# EasyEDA Pro project backup.epro, board PCB_1
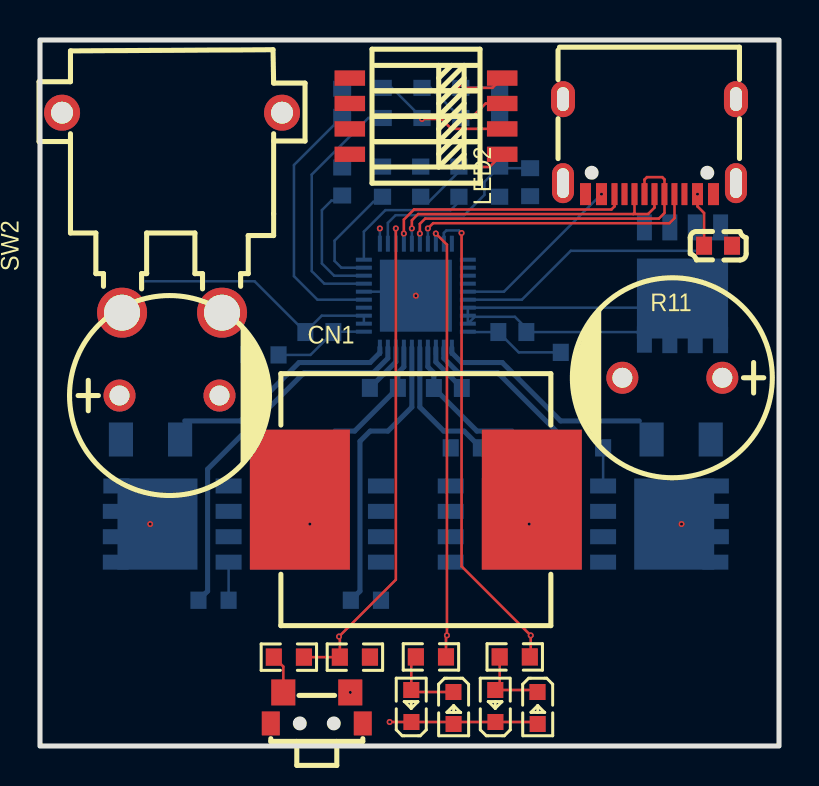
[diagram p8: board, top side]
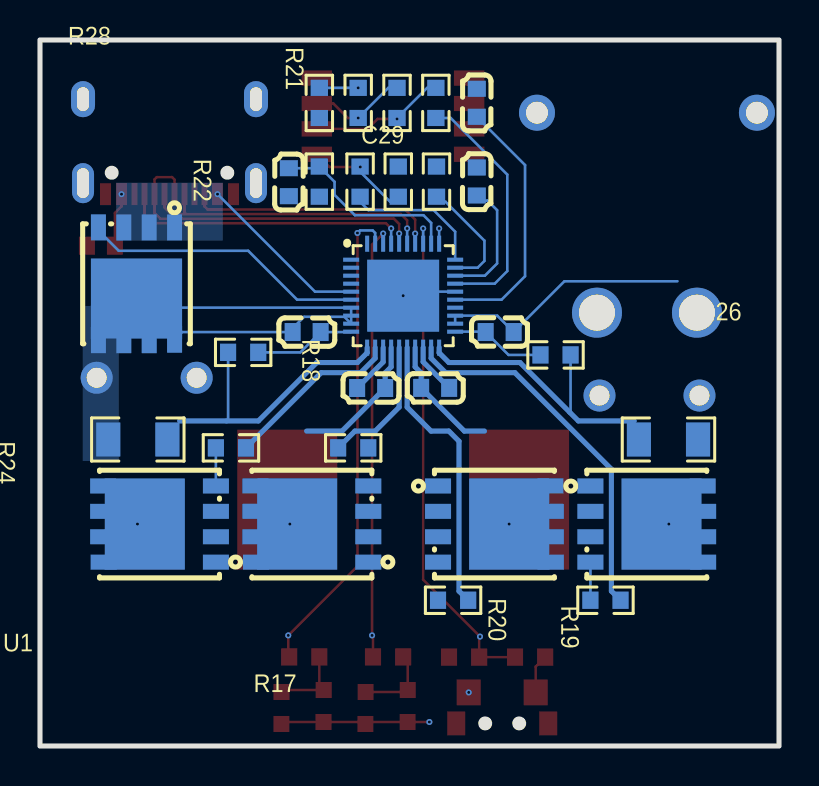
[diagram p9: board, bottom side, seen from below]

Outline 36.96 x 35.31 mm; copper layers: Top Layer, VCC/SIGANL, GND, Bottom Layer. Coordinates in mm from the lower left corner of the outline.
Outline path: rectangle 0,35.31 36.96,0
Stack: Top Layer 0.035mm 外层铜厚1oz / Dielectric1 0.2104mm 7628 RC49% 8.6mil / VCC/SIGANL 0.0152mm 内层铜厚 / Dielectric2 1.065mm 1.1mm H/HOZ 含铜 / GND 0.0152mm 内层铜厚 / Dielectric3 0.2104mm 7628 RC49% 8.6mil / Bottom Layer 0.035mm 外层铜厚1oz

## Design rules (mm)
template: 自定义配置
spacing copperThickness1oz: track to track 0.102, other pairs 0.152 to 0.3
spacing copperThickness2oz: track to track 0.203, other pairs 0.152 to 0.3
spacing 6mil (default): track to track 0.102, other pairs 0.152 to 0.152
track width copperThickness1oz (default): min 0.127, default 0.254, max 2.54
track width copperThickness2oz: min 0.203, default 0.254, max 2.54
track width 10mil: min 0.254, default 0.254, max 2.54
track width 20mil: min 0.508, default 0.508, max 2.54
differential pair differentialPair (default): width min 0.127, default 0.254, max 2.54; gap min 0.152, default 0.152
differential pair err=5mil: width min 0.127, default 0.254, max 2.54; gap min 0.152, default 0.254
via viaSize: diameter min 0.5, default 0.61, max 10; hole min 0.3, default 0.305, max 6.299
via 12-24: diameter min 0.5, default 0.61, max 10; hole min 0.3, default 0.305, max 6.299
via 6-12 (default): diameter min 0.305, default 0.305, max 10; hole min 0.152, default 0.152, max 6.299

## Placement (name value [footprint] x y rotation side)
C20  2.2uF  [C0603]  15.11 32.17 90 bottom
C22  100nF  [C0603]  24.51 28.19 270 bottom
C23  2.2uF  [C0603]  15.11 28.23 90 bottom
C29  470nF  [C0603]  23.62 20.7 0 bottom
C30  470nF  [C0603]  13.97 20.7 180 bottom
C35  1000uF  [CAP-TH_BD10.0-P5.00-D0.6-FD-A]  31.62 18.41 180 top
C36  470nF  [C0603]  20.4 17.9 180 bottom
C37  470nF  [C0603]  17.2 17.91 0 bottom
C38  1000uF  [CAP-TH_BD10.0-P5.00-D0.6-FD-A]  6.48 17.53 0 top
C39  22uF  [C0603]  33.91 25.02 180 top
CN1  XT30PW-M  [CONN-TH_XT30PW-M]  6.6 26.67 180 top
L1  10uH  [IND-SMD_L12.6-W13.5]  18.8 12.32 180 top
LED1  NCD0603R1  [LED0603-RD_RED]  18.57 2 90 top
LED2  NCD0603R1  [LED0603-RD_RED]  20.68 1.9 270 top
LED3  NCD0603R1  [LED0603-RD_RED]  22.77 2 90 top
LED4  NCD0603R1  [LED0603-RD_RED]  24.88 1.9 270 top
Q2  BSC0702LS  [PG-TDSON-8_L5.0-W6.0-P1.27-BL-EP]  32.13 23.11 0 bottom
Q3  BSC0702LS  [PG-TDSON-8_L5.0-W6.0-P1.27-BL-EP]  30.98 11.1 90 bottom
Q4  BSC0702LS  [PG-TDSON-8_L5.0-W6.0-P1.27-BL-EP]  14.23 11.1 270 bottom
Q5  BSC0702LS  [PG-TDSON-8_L5.0-W6.0-P1.27-BL-EP]  23.36 11.1 90 bottom
Q6  BSC0702LS  [PG-TDSON-8_L5.0-W6.0-P1.27-BL-EP]  6.61 11.1 270 bottom
R7  51Ω  [R0603]  26.8 19.68 180 bottom
R8  5mΩ  [R1206]  32.06 15.33 180 bottom
R9  10Ω  [R0603]  11.18 19.56 0 bottom
R10  5mΩ  [R1206]  5.53 15.33 180 bottom
R11  100Ω  [R0603]  19.55 4.45 180 top
R12  100Ω  [R0603]  23.74 4.45 180 top
R15  43kΩ  [R0603]  12.45 4.44 0 top
R16  10kΩ  [R0603]  15.75 4.44 180 top
R17  27kΩ  [R0603]  17.13 28.22 90 bottom
R18  3.6K  [R0603]  20.95 28.22 90 bottom
R19  5.5K  [R0603]  19.04 28.22 90 bottom
R20  6.2K  [R0603]  17.16 32.16 90 bottom
R21  2.9K  [R0603]  19.1 32.16 90 bottom
R22  4.9K  [R0603]  21.05 32.16 90 bottom
R23  5K  [R0603]  22.99 32.16 270 bottom
R24  NCP18XH103F03RB  [R0603]  22.99 28.22 270 bottom
R25  2Ω  [R0603]  27.41 14.91 0 bottom
R26  2Ω  [R0603]  21.29 14.91 180 bottom
R27  2Ω  [R0603]  8.68 7.29 180 bottom
R28  2Ω  [R0603]  16.3 7.29 180 bottom
SW1  TS24CA  [SW-SMD_TS24CA]  13.84 1.9 180 top
SW2  DSHP04TSGET  [SW-SMD_8P-L6.7-W5.4-P1.27-LS8.4]  19.3 31.5 90 top
U1  -  [IP2366]  21.3 20.02 180 bottom
USB1  TYPE-C 16PIN 2MD(073)  [USB-C-SMD_TYPE-C-6PIN-2MD-073]  30.48 29.97 180 top

## Footprints (pads in the part's own frame, mm; a bottom-side part is the same pattern mirrored in y, then rotated)
C0603
  rect 0.8x0.9 smd: 1(-0.7,0) 2(0.7,0)
CAP-TH_BD10.0-P5.00-D0.6-FD-A
  round 1.6 hole 1: 1(-2.5,0) 2(2.5,0)
CONN-TH_XT30PW-M
  round 2.5 hole 1.8: 1(-2.5,5) 2(2.5,5)
  round 1.8 hole 1.1: 3(5.5,-5) 4(-5.5,-5)
IND-SMD_L12.6-W13.5
  rect 5x7 smd: 1(-5.8,0) 2(5.8,0)
IP2366
  rect 0.8x0.2 smd: 1(-0.1,4.3) 2(-0.1,3.9) 3(-0.1,3.5) 4(-0.1,3.1) 5(-0.1,2.7) 6(-0.1,2.3) 7(-0.1,1.9) 8(-0.1,1.5) 9(-0.1,1.1) 10(-0.1,0.7) 21(5.1,0.7) 22(5.1,1.1) 23(5.1,1.5) 24(5.1,1.9) 25(5.1,2.3) 26(5.1,2.7) 27(5.1,3.1) 28(5.1,3.5) 29(5.1,3.9) 30(5.1,4.3)
  rect 0.2x0.8 smd: 11(0.7,-0.1) 12(1.1,-0.1) 13(1.5,-0.1) 14(1.9,-0.1) 15(2.3,-0.1) 16(2.7,-0.1) 17(3.1,-0.1) 18(3.5,-0.1) 19(3.9,-0.1) 20(4.3,-0.1) 31(4.3,5.1) 32(3.9,5.1) 33(3.5,5.1) 34(3.1,5.1) 35(2.7,5.1) 36(2.3,5.1) 37(1.9,5.1) 38(1.5,5.1) 39(1.1,5.1) 40(0.7,5.1)
  rect 3.6x3.6 smd: 41(2.5,2.5)
LED0603-RD_RED
  rect 0.8x0.8 smd: 1(-0.799,-0.004) 2(0.799,0.004)
PG-TDSON-8_L5.0-W6.0-P1.27-BL-EP
  rect 0.75x1.3 smd: 1(-1.905,-2.82) 2(-0.635,-2.82) 3(0.635,-2.82) 4(1.905,-2.82) 5(1.905,2.82) 6(0.635,2.82) 7(-0.635,2.82) 8(-1.905,2.794)
  rect 4.56x4 smd: 8(0,0.737)
R0603
  rect 0.806x0.864 smd: 1(-0.753,0) 2(0.753,0)
R1206
  rect 1.208x1.701 smd: 1(-1.479,0) 2(1.479,0)
SW-SMD_8P-L6.7-W5.4-P1.27-LS8.4
  rect 0.762x1.524 smd: 1(-1.905,-3.81) 2(-0.635,-3.81) 3(0.635,-3.81) 4(1.905,-3.81) 5(1.905,3.81) 6(0.635,3.81) 7(-0.635,3.81) 8(-1.905,3.81)
SW-SMD_TS24CA
  rect 0.9x1.2 smd: 1(-2.3,0.775) 2(2.3,0.775)
  rect 1.2x1.3 smd: 3(-1.675,-0.775) 4(1.675,-0.775)
USB-C-SMD_TYPE-C-6PIN-2MD-073
  rect 0.55x1.1 smd: 1(-3.2,2.375) 2(-2.4,2.375) 11(2.4,2.375) 12(3.2,2.375)
  rect 0.3x1.1 smd: 3(-1.75,2.375) 4(-1.25,2.375) 5(-0.75,2.375) 6(-0.25,2.375) 7(0.25,2.375) 8(0.75,2.375) 9(1.25,2.375) 10(1.75,2.375)
  oval 1.1x2 hole 0.6x1.5: 13(-4.325,1.825) 14(4.325,1.825)
  oval 1.2x1.8 hole 0.6x1.2: 13(-4.325,-2.375) 14(4.325,-2.375)

## Nets
As in the schematic.

Pads without a net: U1 1 2 3 4 24 40; USB1 3 9

## Via types
v1: diameter 0.305, hole 0.152, Top Layer to Bottom Layer, 24 vias

## Routing (per net, layer and track width the routed paths; a pad name or vN(x,y) marks a point on that pad's centre or on a via; arc(x,y) is an arc through that point)
GND: length 2.7
  Bottom Layer w0.127: U1.26 18.6,22.72 v1(18.8,22.52)
VBUS: length 11.4
  Top Layer w0.127: v1(32.88,27.6) 32.88,26.98 33.21,26.65 33.21,25.02
  Bottom Layer w0.127: U1.5 23.2,22.72 v1(28.08,27.6)
3S: length 6.8
  Top Layer w0.127: v1(19.1,31.36) 20.08,31.36 20.57,30.86 SW2.2
  Bottom Layer w0.127: R21.1 17.6,32.91 R20.2
4S: length 4.9
  Top Layer w0.127: SW2.3 22.29,32.13 21.56,31.41 v1(21.05,31.41)
  Bottom Layer w0.127: R21.2 19.54,32.91 v1(21.05,31.41)
5S: length 4.2
  Top Layer w0.127: SW2.4 22.63,32.91 v1(21.05,32.91)
  Bottom Layer w0.127: R23.1 v1(21.05,32.91)
$C20_1: length 13
  Bottom Layer w0.127: C20.1 12.7,29.05 12.7,23.49 13.88,22.32 U1.25
$C23_1: length 6.2
  Bottom Layer w0.127: 15.11,27.28 14.58,27.28 14.1,26.8 14.1,24.13 14.71,23.52 U1.28
$C29_1: length 5.1
  Bottom Layer w0.127: R7.2 23.94,19.68 C29.1 21.41,20.7 U1.10
$C29_2: length 21.3
  Bottom Layer w0.127: Q2.8 31.67,21.92 U1.7 U1.8 U1.9 21.74,21.46 23.75,21.46 24.32,20.89 C29.2 29.84,20.7 Q2.8
$C30_1: length 4.7
  Bottom Layer w0.127: R9.2 13.53,19.56 C30.1 14.69,20.72 U1.21
$C36_1: length 2.6
  Bottom Layer w0.254: U1.13 19.8,19.2 C36.1
$C36_2: length 7
  Bottom Layer w0.254: 23.62,15.75 21.85,15.75 C36.2 19.7,18.66 19.4,18.96 U1.14
  vias: v1(24.46,11.1)
$C37_1: length 2.5
  Bottom Layer w0.254: C37.1 17.8,19.21 U1.18
$C37_2: length 6.2
  Bottom Layer w0.254: 14.73,15.75 15.74,15.75 C37.2 17.9,18.66 18.2,18.96 U1.17
  vias: v1(13.5,11.1)
$LED1_2: length 3.9
  Top Layer w0.127: R11.2 18.57,4.22 LED1.2 18.67,2.7 LED2.1
$LED3_2: length 3.9
  Top Layer w0.127: LED4.1 24.78,2.8 LED3.2 22.99,3.02 R12.2
$Q2_4: length 14.2
  Bottom Layer w0.127: U1.6 24.1,22.32 26.54,24.76 33.02,24.76 34.04,25.78 Q2.4
$Q3_4: length 1.9
  Bottom Layer w0.127: 28.16,13 R25.2
$Q3_5: length 14.5
  Bottom Layer w0.127: R7.1 27.55,16.33 27.63,16.26
  Bottom Layer w0.254: 29.97,16.26 26.03,16.26 23.11,19.18 21.08,19.18 20.6,19.66 U1.11
  vias: v1(32.08,11.1)
$Q6_4: length 1.9
  Bottom Layer w0.127: R27.1 Q6.4
$Q6_5: length 14.3
  Bottom Layer w0.127: R9.1 10.42,16.72 10.46,16.68
  Bottom Layer w0.254: U1.20 17,19.66 16.51,19.18 12.95,19.18 10.03,16.26 7.24,16.26
  vias: v1(5.51,11.1)
$R15_1: length 2
  Top Layer w0.127: R15.1 12.17,3.97 SW1.4
$R17_1: length 5.8
  Bottom Layer w0.127: U1.29 15.07,23.92 14.73,24.26 14.73,25.27 16.67,27.21 17.13,27.21
BAT: length 32.5
  VCC/SIGANL w0.127: v1(15.52,2.68) 3.98,14.22 C38.1
  Bottom Layer w0.127: 5.08,23.24 10.73,23.24 C30.2 14.09,21.52 U1.23 U1.22
BAT_NUM: length 12.4
  Bottom Layer w0.127: R20.1 16.42,31.41 13.59,28.57 13.59,23.75 14.22,23.12 U1.27
CC1: length 14.5
  Top Layer w0.127: USB1.4 31.73,26.4 31.48,26.15 19.66,26.15 v1(19.4,25.88)
  Bottom Layer w0.127: v1(19.4,25.88) U1.37
CC2: length 12.6
  Top Layer w0.127: v1(18.2,25.63) 18.2,26.32 18.7,26.83 28.58,26.83 28.73,26.98 USB1.10
  Bottom Layer w0.127: v1(18.2,25.63) U1.34
DM: length 17
  Top Layer w0.127: v1(19,25.63) 19,26.11 19.26,26.37 30.95,26.37 31.23,26.66 USB1.5 31.23,28.33 31.12,28.45 30.35,28.45 30.23,28.32 USB1.7
  Bottom Layer w0.127: v1(19,25.63) U1.36
DP: length 15.3
  Top Layer w0.127: USB1.6 30.73,26.92 30.41,26.6 29.68,26.6 ; 29.68,26.6 29.73,26.66 USB1.8 ; 29.68,26.6 18.91,26.6 18.6,26.29 v1(18.6,25.88)
  Bottom Layer w0.127: v1(18.6,25.88) U1.35
EN: length 25.2
  Top Layer w0.127: v1(17.8,25.88) 17.8,8.31 v1(14.95,5.47) 14.99,5.43 R16.2 R15.2
  Bottom Layer w0.127: v1(17.8,25.88) U1.33
HG1: length 8.8
  Bottom Layer w0.254: U1.12 20.2,19.39 20.92,18.67 22.89,18.67 R25.1
HG2: length 18.6
  Bottom Layer w0.254: U1.19 17.4,19.39 16.67,18.67 13.21,18.67 8.38,13.84 8.38,7.75 7.93,7.29
LED1: length 24.2
  Top Layer w0.127: 24.49,4.45 24.54,4.5 v1(24.54,5.53) 21.08,8.99 v1(21.08,25.65)
  Bottom Layer w0.127: v1(21.08,25.65) 20.96,25.78 20.32,25.78 20.2,25.66 U1.39
LED2: length 21.9
  Top Layer w0.127: R11.1 20.3,5.48 v1(20.35,5.53) 20.35,25.07 v1(19.8,25.63)
  Bottom Layer w0.127: v1(19.8,25.63) U1.38
LED3: length 33.1
  Top Layer w0.127: LED1.1 LED3.1 24.79,1.2 LED4.2 ; v1(17.49,1.2) 18.57,1.2
  VCC/SIGANL w0.127: v1(17,25.88) 17.49,25.39 v1(17.49,1.2)
  Bottom Layer w0.127: v1(17,25.88) U1.31
LG1: length 6.9
  Bottom Layer w0.254: 22.05,14.91 21.21,15.75 20.19,15.75 19,16.94 U1.15
LG2: length 14.4
  Bottom Layer w0.254: 15.55,7.29 16,7.75 16,15.24 16.51,15.75 17.4,15.75 18.6,16.94 U1.16
NTC: length 9.7
  Bottom Layer w0.127: U1.32 17.4,26.16 17.78,26.54 21.21,26.54 22.22,27.56 22.22,28.21 R24.1 23.07,28.89 C22.1
SET: length 5
  Top Layer w0.127: v1(20.94,28.96) 22.48,28.96 SW2.1
  Bottom Layer w0.127: 19.04,27.21 19.44,27.21 20.95,28.72
VSET: length 6.8
  Bottom Layer w0.127: U1.30 16.2,25.72 17.27,26.8 20.53,26.8 20.95,27.21

## Copper pours and planes (outline as drawn; the poured copper is in the pictures)
GND on Top Layer: -2.41,38.23 39.37,38.23 39.37,-3.3 -2.41,-3.3
GND on Bottom Layer: -3.68,41.15 42.16,41.15 42.16,-5.08 -3.68,-5.08
VBUS on Bottom Layer: 27.81,28.17 33.15,28.17 33.15,25.27 27.81,25.27
$C29_2 on Bottom Layer: 33.02,22.01 34.82,22.01 34.82,14.25 33.02,14.25
$C36_2 on Top Layer: 21.97,15.88 28.96,15.88 28.96,8.41 21.97,8.41
$C36_2 on Bottom Layer: 21.97,15.88 28.96,15.88 28.96,8.41 21.97,8.41
$C36_2 on VCC/SIGANL: 21.97,15.88 28.96,15.88 28.96,8.41 21.97,8.41
$C37_2 on Top Layer: 8.65,15.88 15.62,15.88 15.62,8.41 8.65,8.41
$C37_2 on Bottom Layer: 8.65,15.88 15.62,15.88 15.62,8.41 8.65,8.41
$C37_2 on VCC/SIGANL: 8.65,15.88 15.62,15.88 15.62,8.41 8.65,8.41
$Q3_5 on Top Layer: 29.59,16.41 31.24,16.41 31.24,14.23 31.67,13.79 34.54,13.79 34.54,8.41 29.59,8.41
$Q3_5 on Bottom Layer: 29.59,16.41 31.24,16.41 31.24,14.23 31.67,13.79 34.54,13.79 34.54,8.41 29.59,8.41
$Q3_5 on VCC/SIGANL: 29.59,16.41 31.24,16.41 31.24,14.23 31.67,13.79 34.54,13.79 34.54,8.41 29.59,8.41
$Q4_4 on Bottom Layer: 16.72,9.57 17.7,9.57 17.7,6.63 16.72,6.63
$Q5_4 on Bottom Layer: 19.89,15.57 20.87,15.57 20.87,12.63 19.89,12.63
$Q6_5 on Top Layer: 7.97,16.41 7.97,8.41 3.05,8.41 3.05,13.79 5.9,13.79 6.35,14.25 6.35,16.41
$Q6_5 on Bottom Layer: 7.97,16.41 7.97,8.41 3.05,8.41 3.05,13.79 5.89,13.79 6.35,14.25 6.35,16.41
$Q6_5 on VCC/SIGANL: 7.97,16.41 7.97,8.41 3.05,8.41 3.05,13.79 5.9,13.79 6.35,14.25 6.35,16.41
BAT on Bottom Layer: 2.79,23.62 5.33,23.62 5.33,14.14 2.79,14.14
